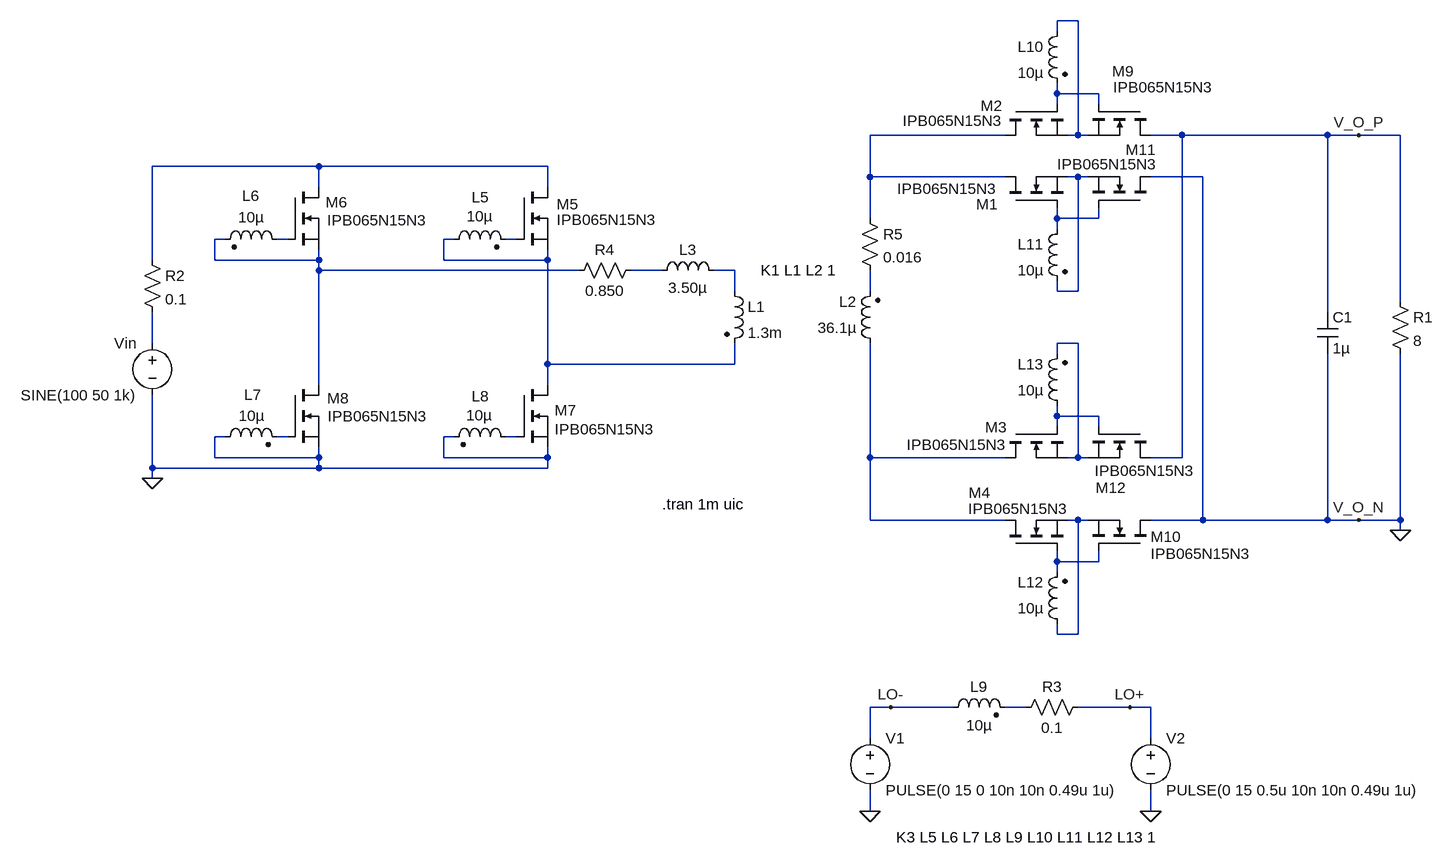
[diagram p0: schematic ssopt-v1.asc]
ssopt-v1.asc, the LTspice schematic file:
Version 4
SHEET 1 1008 936
WIRE 320 -336 288 -336
WIRE 288 -320 288 -336
WIRE 288 -224 288 -240
WIRE 352 -224 288 -224
WIRE 288 -208 288 -224
WIRE 352 -208 352 -224
WIRE 208 -160 0 -160
WIRE 320 -160 320 -336
WIRE 320 -160 304 -160
WIRE 336 -160 320 -160
WIRE 480 -160 432 -160
WIRE 704 -160 480 -160
WIRE 752 -160 704 -160
WIRE 816 -160 752 -160
WIRE -848 -112 -1104 -112
WIRE -496 -112 -848 -112
WIRE 0 -96 0 -160
WIRE 208 -96 0 -96
WIRE 320 -96 304 -96
WIRE 336 -96 320 -96
WIRE 512 -96 432 -96
WIRE -848 -80 -848 -112
WIRE -496 -80 -496 -112
WIRE 0 -32 0 -96
WIRE 288 -32 288 -48
WIRE 352 -32 352 -48
WIRE 352 -32 288 -32
WIRE 288 -16 288 -32
WIRE -992 0 -1008 0
WIRE -896 0 -912 0
WIRE -640 0 -656 0
WIRE -544 0 -560 0
WIRE -1104 32 -1104 -112
WIRE -1008 32 -1008 0
WIRE -848 32 -848 16
WIRE -848 32 -1008 32
WIRE -656 32 -656 0
WIRE -496 32 -496 16
WIRE -496 32 -656 32
WIRE -848 48 -848 32
WIRE -448 48 -848 48
WIRE -320 48 -368 48
WIRE -208 48 -240 48
WIRE -208 80 -208 48
WIRE 0 80 0 48
WIRE 288 80 288 64
WIRE 320 80 320 -96
WIRE 320 80 288 80
WIRE 816 96 816 -160
WIRE 704 112 704 -160
WIRE -1104 160 -1104 112
WIRE 320 160 288 160
WIRE 288 176 288 160
WIRE -496 192 -496 32
WIRE -208 192 -208 160
WIRE -208 192 -496 192
WIRE -848 224 -848 48
WIRE -496 224 -496 192
WIRE 288 272 288 256
WIRE 352 272 288 272
WIRE 288 288 288 272
WIRE 352 288 352 272
WIRE -992 304 -1008 304
WIRE -896 304 -912 304
WIRE -640 304 -656 304
WIRE -544 304 -560 304
WIRE -1008 336 -1008 304
WIRE -848 336 -848 320
WIRE -848 336 -1008 336
WIRE -656 336 -656 304
WIRE -496 336 -496 320
WIRE -496 336 -656 336
WIRE 0 336 0 160
WIRE 208 336 0 336
WIRE 320 336 320 160
WIRE 320 336 304 336
WIRE 336 336 320 336
WIRE 480 336 480 -160
WIRE 480 336 432 336
WIRE -1104 352 -1104 240
WIRE -848 352 -848 336
WIRE -848 352 -1104 352
WIRE -496 352 -496 336
WIRE -496 352 -848 352
WIRE -1104 368 -1104 352
WIRE 0 432 0 336
WIRE 208 432 0 432
WIRE 320 432 304 432
WIRE 336 432 320 432
WIRE 512 432 512 -96
WIRE 512 432 432 432
WIRE 704 432 704 176
WIRE 704 432 512 432
WIRE 752 432 704 432
WIRE 816 432 816 176
WIRE 816 432 752 432
WIRE 816 448 816 432
WIRE 288 496 288 480
WIRE 352 496 352 480
WIRE 352 496 288 496
WIRE 288 512 288 496
WIRE 288 608 288 592
WIRE 320 608 320 432
WIRE 320 608 288 608
WIRE 32 720 0 720
WIRE 128 720 32 720
WIRE 240 720 208 720
WIRE 400 720 320 720
WIRE 432 720 400 720
WIRE 0 768 0 720
WIRE 432 768 432 720
WIRE 0 880 0 848
WIRE 432 880 432 848
FLAG 0 880 0
FLAG 432 880 0
FLAG 400 720 LO+
FLAG 32 720 LO-
FLAG 752 -160 V_O_P
FLAG -1104 368 0
FLAG 816 448 0
FLAG 752 432 V_O_N
SYMBOL res 800 80 R0
SYMATTR InstName R1
SYMATTR Value 8
SYMBOL ind2 16 176 R180
WINDOW 0 36 80 Left 2
WINDOW 3 36 40 Left 2
SYMATTR InstName L2
SYMATTR Value 36.1µ
SYMATTR Type ind
SYMATTR SpiceLine Rser=0.1
SYMBOL ind2 -224 64 R0
SYMATTR InstName L1
SYMATTR Value 1.3m
SYMATTR Type ind
SYMATTR SpiceLine Rser=0.1
SYMBOL nmos -544 -80 R0
WINDOW 0 62 26 Left 2
WINDOW 3 62 50 Left 2
SYMATTR InstName M5
SYMATTR Value IPB065N15N3
SYMBOL nmos -896 -80 R0
WINDOW 0 59 23 Left 2
WINDOW 3 61 51 Left 2
SYMATTR InstName M6
SYMATTR Value IPB065N15N3
SYMBOL nmos -544 224 R0
WINDOW 0 59 39 Left 2
WINDOW 3 59 68 Left 2
SYMATTR InstName M7
SYMATTR Value IPB065N15N3
SYMBOL nmos -896 224 R0
WINDOW 0 61 21 Left 2
WINDOW 3 62 48 Left 2
SYMATTR InstName M8
SYMATTR Value IPB065N15N3
SYMBOL voltage -1104 144 M0
WINDOW 123 0 0 Left 0
WINDOW 39 0 0 Left 0
SYMATTR InstName Vin
SYMATTR Value SINE(100 50 1k)
SYMBOL voltage 0 752 R0
WINDOW 123 0 0 Left 0
WINDOW 39 0 0 Left 0
SYMATTR InstName V1
SYMATTR Value PULSE(0 15 0 10n 10n 0.49u 1u)
SYMBOL voltage 432 752 R0
WINDOW 123 0 0 Left 0
WINDOW 39 0 0 Left 0
SYMATTR InstName V2
SYMATTR Value PULSE(0 15 0.5u 10n 10n 0.49u 1u)
SYMBOL ind2 -656 16 R270
WINDOW 0 65 57 VTop 2
WINDOW 3 67 56 VBottom 2
SYMATTR InstName L5
SYMATTR Value 10µ
SYMATTR Type ind
SYMBOL ind2 -896 16 M270
WINDOW 0 67 56 VTop 2
WINDOW 3 65 56 VBottom 2
SYMATTR InstName L6
SYMATTR Value 10µ
SYMATTR Type ind
SYMBOL ind2 -1008 320 R270
WINDOW 0 65 59 VTop 2
WINDOW 3 64 57 VBottom 2
SYMATTR InstName L7
SYMATTR Value 10µ
SYMATTR Type ind
SYMBOL ind2 -544 320 M270
WINDOW 0 63 55 VTop 2
WINDOW 3 65 57 VBottom 2
SYMATTR InstName L8
SYMATTR Value 10µ
SYMATTR Type ind
SYMBOL ind2 112 736 R270
WINDOW 0 32 56 VTop 2
WINDOW 3 4 56 VBottom 2
SYMATTR InstName L9
SYMATTR Value 10µ
SYMATTR Type ind
SYMBOL res -1120 16 R0
SYMATTR InstName R2
SYMATTR Value 0.1
SYMBOL res 224 736 R270
WINDOW 0 32 56 VTop 2
WINDOW 3 0 56 VBottom 2
SYMATTR InstName R3
SYMATTR Value 0.1
SYMBOL nmos 208 -208 M90
WINDOW 0 154 -11 VLeft 2
WINDOW 3 130 -12 VLeft 2
SYMATTR InstName M1
SYMATTR Value IPB065N15N3
SYMBOL nmos 208 -48 R270
WINDOW 0 157 -4 VLeft 2
WINDOW 3 134 -4 VLeft 2
SYMATTR InstName M2
SYMATTR Value IPB065N15N3
SYMBOL nmos 208 288 M90
WINDOW 0 1 3 VLeft 2
WINDOW 3 28 2 VLeft 2
SYMATTR InstName M3
SYMATTR Value IPB065N15N3
SYMBOL nmos 208 480 R270
WINDOW 0 90 -56 VRight 2
WINDOW 3 65 -57 VRight 2
SYMATTR InstName M4
SYMATTR Value IPB065N15N3
SYMBOL ind2 304 -336 M0
SYMATTR InstName L10
SYMATTR Value 10µ
SYMATTR Type ind
SYMBOL ind2 304 -32 M0
SYMATTR InstName L11
SYMATTR Value 10µ
SYMATTR Type ind
SYMBOL ind2 304 608 R180
WINDOW 0 36 80 Left 2
WINDOW 3 36 40 Left 2
SYMATTR InstName L12
SYMATTR Value 10µ
SYMATTR Type ind
SYMBOL ind2 304 272 R180
WINDOW 0 36 80 Left 2
WINDOW 3 36 40 Left 2
SYMATTR InstName L13
SYMATTR Value 10µ
SYMATTR Type ind
SYMBOL nmos 432 -208 R90
WINDOW 0 -50 59 VLeft 2
WINDOW 3 -26 58 VLeft 2
SYMATTR InstName M9
SYMATTR Value IPB065N15N3
SYMBOL nmos 432 480 M270
WINDOW 0 22 0 VLeft 2
WINDOW 3 124 86 VLeft 2
SYMATTR InstName M10
SYMATTR Value IPB065N15N3
SYMBOL nmos 432 -48 M270
WINDOW 0 90 -9 VRight 2
WINDOW 3 67 -10 VRight 2
SYMATTR InstName M11
SYMATTR Value IPB065N15N3
SYMBOL nmos 432 288 R90
WINDOW 0 94 85 VLeft 2
WINDOW 3 196 0 VLeft 2
SYMATTR InstName M12
SYMATTR Value IPB065N15N3
SYMBOL cap 688 112 R0
SYMATTR InstName C1
SYMATTR Value 1µ
SYMBOL res -352 32 R90
WINDOW 0 0 56 VBottom 2
WINDOW 3 32 56 VTop 2
SYMATTR InstName R4
SYMATTR Value 0.850
SYMBOL res -16 -48 R0
SYMATTR InstName R5
SYMATTR Value 0.016
SYMBOL ind -336 64 R270
WINDOW 0 32 56 VTop 2
WINDOW 3 5 56 VBottom 2
SYMATTR InstName L3
SYMATTR Value 3.50µ
TEXT -320 408 Left 2 !.tran 1m uic
TEXT -168 48 Left 2 !K1 L1 L2 1
TEXT 40 920 Left 2 !K3 L5 L6 L7 L8 L9 L10 L11 L12 L13 1

The netlist it stands for:
* ssopt-v1.asc
R1 V_O_P 0 8
L2 N019 N013 36.1µ Rser=0.1
L1 N012 N009 1.3m Rser=0.1
M5 N004 N010 N009 N009 IPB065N15N3
M6 N004 N008 N007 N007 IPB065N15N3
M7 N009 N018 0 0 IPB065N15N3
M8 N007 N017 0 0 IPB065N15N3
Vin N014 0 SINE(100 50 1k)
V1 LO- 0 PULSE(0 15 0 10n 10n 0.49u 1u)
V2 LO+ 0 PULSE(0 15 0.5u 10n 10n 0.49u 1u)
L5 N009 N010 10µ
L6 N008 N007 10µ
L7 0 N017 10µ
L8 N018 0 10µ
L9 LO- N022 10µ
R2 N004 N014 0.1
R3 N022 LO+ 0.1
M1 N003 N002 N001 N001 IPB065N15N3
M2 N003 N006 N005 N005 IPB065N15N3
M3 N019 N016 N015 N015 IPB065N15N3
M4 N019 N021 N020 N020 IPB065N15N3
L10 N001 N002 10µ
L11 N006 N005 10µ
L12 N020 N021 10µ
L13 N016 N015 10µ
M9 V_O_P N002 N001 N001 IPB065N15N3
M10 0 N021 N020 N020 IPB065N15N3
M11 0 N006 N005 N005 IPB065N15N3
M12 V_O_P N016 N015 N015 IPB065N15N3
C1 V_O_P 0 1µ
R4 N011 N007 0.850
R5 N003 N013 0.016
L3 N011 N012 3.50µ
.model NMOS NMOS
.model PMOS PMOS
.lib standard.mos
.tran 1m uic
K1 L1 L2 1
K3 L5 L6 L7 L8 L9 L10 L11 L12 L13 1
.backanno
.end